# EAGLE schematic mrShark Blanco-Adapter (EAGLE 6.3)
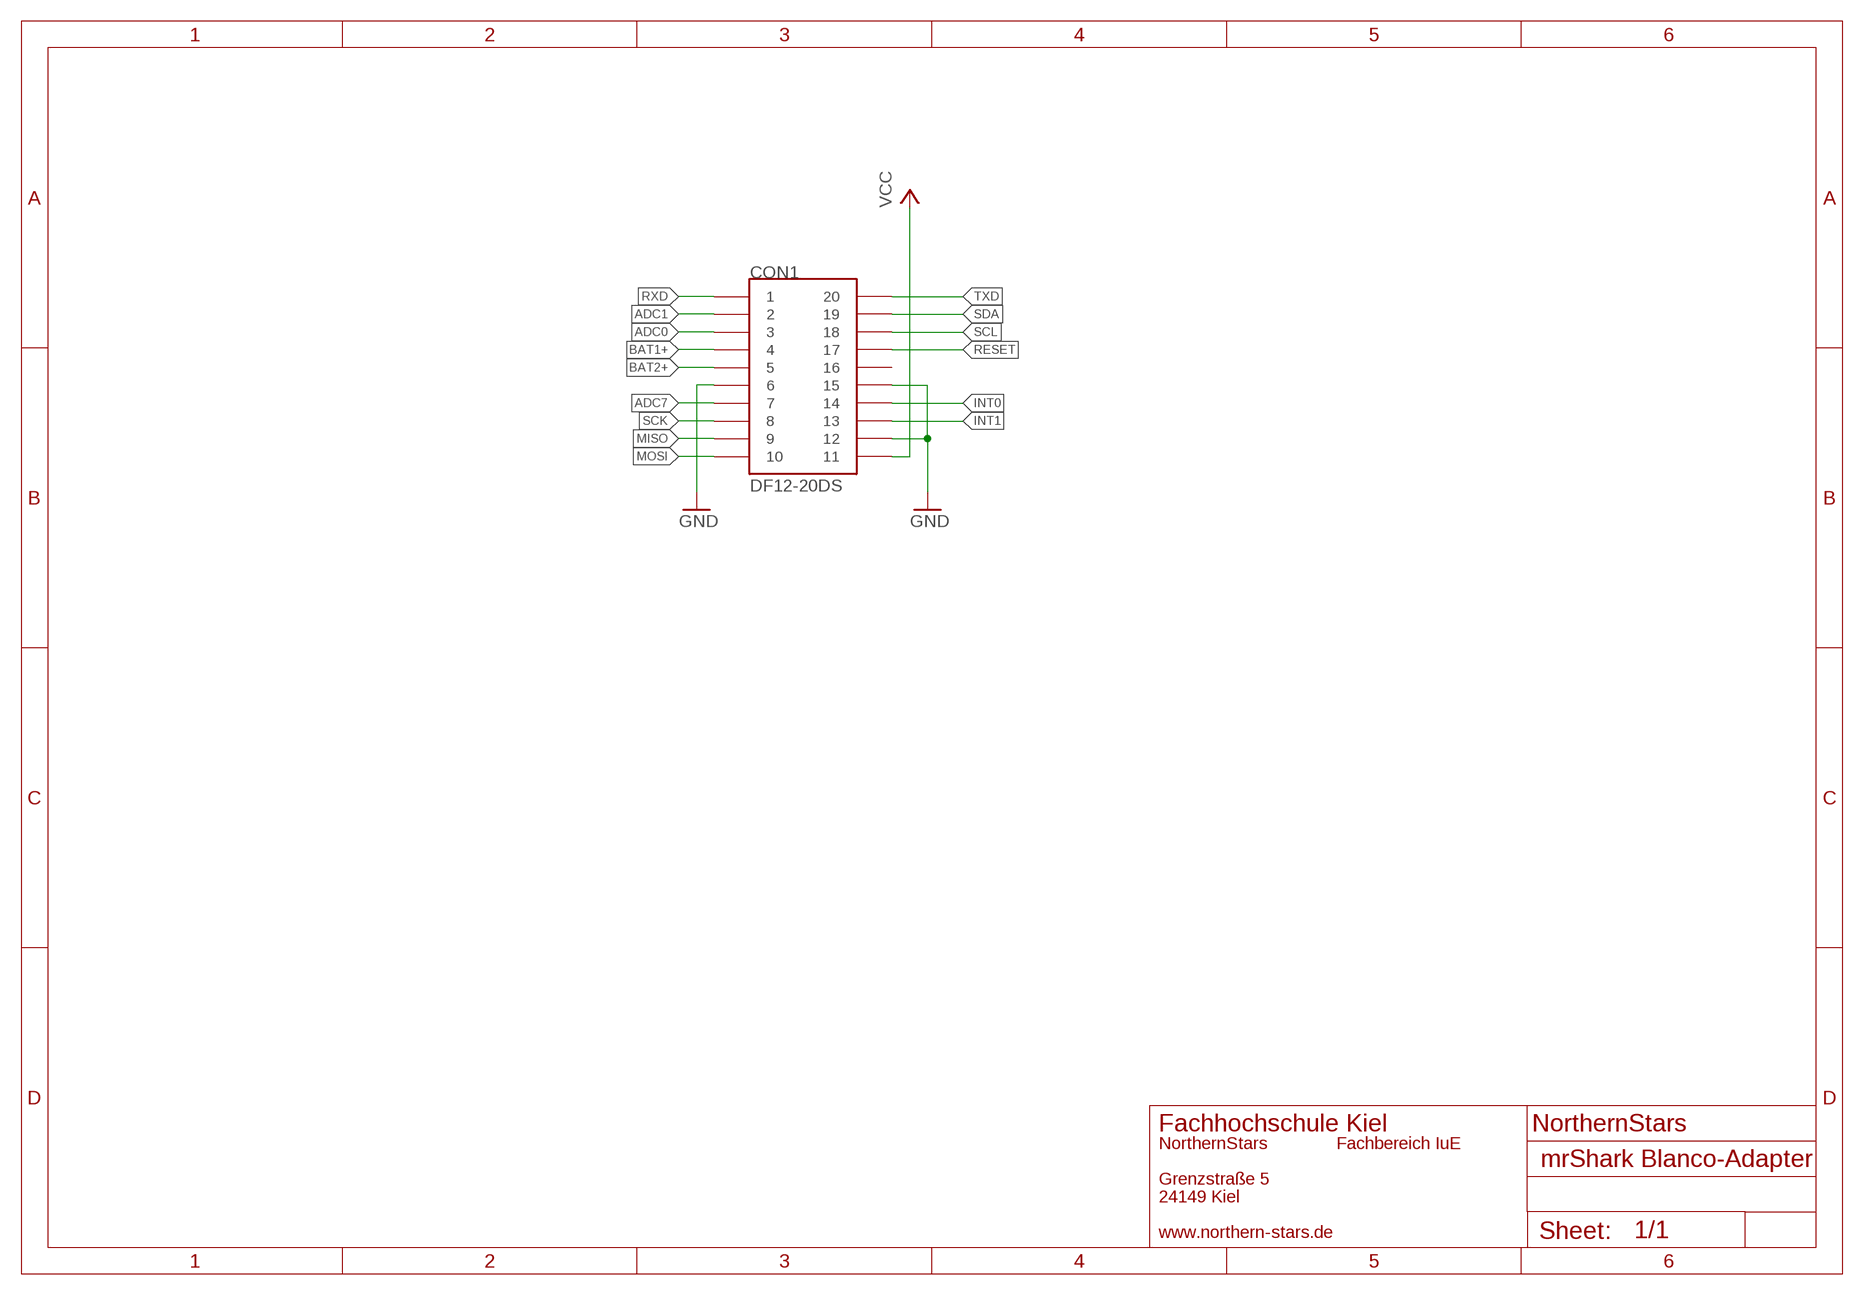
[diagram p0: schematic, sheet 1]

## Parts
CON1  DF12-20DS  [DF12-20DS]

## Nets
ADC0: CON1.3
ADC1: CON1.2
ADC7: CON1.7
BAT1+: CON1.4
BAT2+: CON1.5
GND: CON1.6 CON1.12 CON1.15
INT0: CON1.14
INT1: CON1.13
MISO: CON1.9
MOSI: CON1.10
RESET: CON1.17
RXD: CON1.1
SCK: CON1.8
SCL: CON1.18
SDA: CON1.19
TXD: CON1.20
VCC: CON1.11
Unconnected: CON1.16

## Notes on the sheet
- Fachhochschule Kiel | NorthernStars
- NorthernStars | Fachbereich IuE
- Grenzstraße 5
- 24149 Kiel
- www.northern-stars.de

## Library data of the parts
CON1 = con-hirose:DF12-20: HRS-Hirose DF12-Series 0.5mm Pitch SMT Board to Board Connector 20 contacts